# EAGLE design 2 pin plank (EAGLE 6.2)
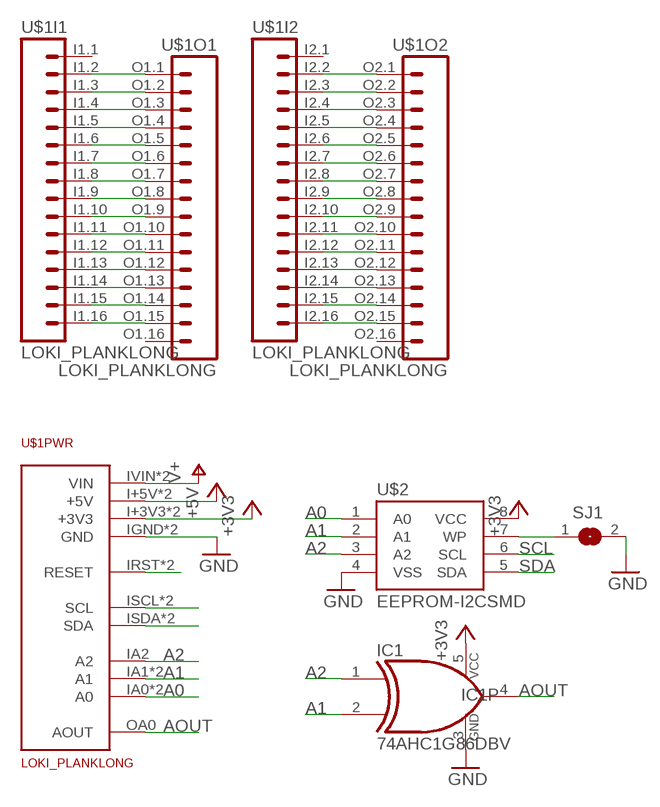
[diagram p0: schematic, sheet 1]

## Parts
IC1  74AHC1G86DBV  [SOT23-5]
SJ1  SJ  [SJ]
U$1  LOKI_PLANKLONG  [PLANK_LONG]
U$2  EEPROM-I2CSMD  [SO08]

## Nets
+3V3: IC1.5(VCC) U$1.I+3V3(PWR:+3V3) U$1.O+3V3(PWR:+3V3) U$2.8(VCC)
+5V: U$1.I+5V(PWR:+5V) U$1.O+5V(PWR:+5V)
A0: U$1.IA0(PWR:A0) U$1.OA1(PWR:A0) U$2.1(A0)
A1: IC1.2(I1) U$1.IA1(PWR:A1) U$1.OA2(PWR:A1) U$2.2(A1)
A2: IC1.1(I0) U$1.IA2(PWR:A2) U$2.3(A2)
AOUT: IC1.4(O) U$1.OA0(PWR:AOUT)
GND: IC1.3(GND) SJ1.2 U$1.IGND(PWR:GND) U$1.OGND(PWR:GND) U$2.4(VSS)
N$1: U$1.I1.16 U$1.O1.15
N$2: U$1.I1.15 U$1.O1.14
N$3: U$1.I1.14 U$1.O1.13
N$4: U$1.I1.13 U$1.O1.12
N$5: U$1.I1.12 U$1.O1.11
N$6: U$1.I1.11 U$1.O1.10
N$7: U$1.I1.10 U$1.O1.9
N$8: U$1.I1.9 U$1.O1.8
N$9: U$1.I1.8 U$1.O1.7
N$10: U$1.I1.7 U$1.O1.6
N$11: U$1.I1.6 U$1.O1.5
N$12: U$1.I1.5 U$1.O1.4
N$13: U$1.I1.4 U$1.O1.3
N$14: U$1.I1.3 U$1.O1.2
N$15: U$1.I1.2 U$1.O1.1
N$16: U$1.I2.16 U$1.O2.15
N$17: U$1.I2.15 U$1.O2.14
N$18: U$1.I2.14 U$1.O2.13
N$19: U$1.I2.13 U$1.O2.12
N$20: U$1.I2.12 U$1.O2.11
N$21: U$1.I2.11 U$1.O2.10
N$22: U$1.I2.10 U$1.O2.9
N$23: U$1.I2.9 U$1.O2.8
N$24: U$1.I2.8 U$1.O2.7
N$25: U$1.I2.7 U$1.O2.6
N$26: U$1.I2.6 U$1.O2.5
N$27: U$1.I2.5 U$1.O2.4
N$28: U$1.I2.4 U$1.O2.3
N$29: U$1.I2.3 U$1.O2.2
N$30: U$1.I2.2 U$1.O2.1
N$31: SJ1.1 U$2.7(WP)
N$32: U$1.IRST(PWR:RESET) U$1.ORST(PWR:RESET)
SCL: U$1.ISCL(PWR:SCL) U$1.OSCL(PWR:SCL) U$2.6(SCL)
SDA: U$1.ISDA(PWR:SDA) U$1.OSDA(PWR:SDA) U$2.5(SDA)
V+: U$1.IVIN(PWR:VIN) U$1.OVIN(PWR:VIN)
Unconnected: U$1.I1.1 U$1.I2.1 U$1.O1.16 U$1.O2.16

## Library data of the parts
IC1 = 74xx-little-us:74*1G86: 2-input EXCLUSIV-OR gate
SJ1 = jumper:SJ: SMD solder JUMPER
U$1 = loki:LOKI_PLANK
U$2 = SparkFun-DigitalIC:EEPROM-I2C: I2C EEPROM chips, 24LC256 (and others)

## Board
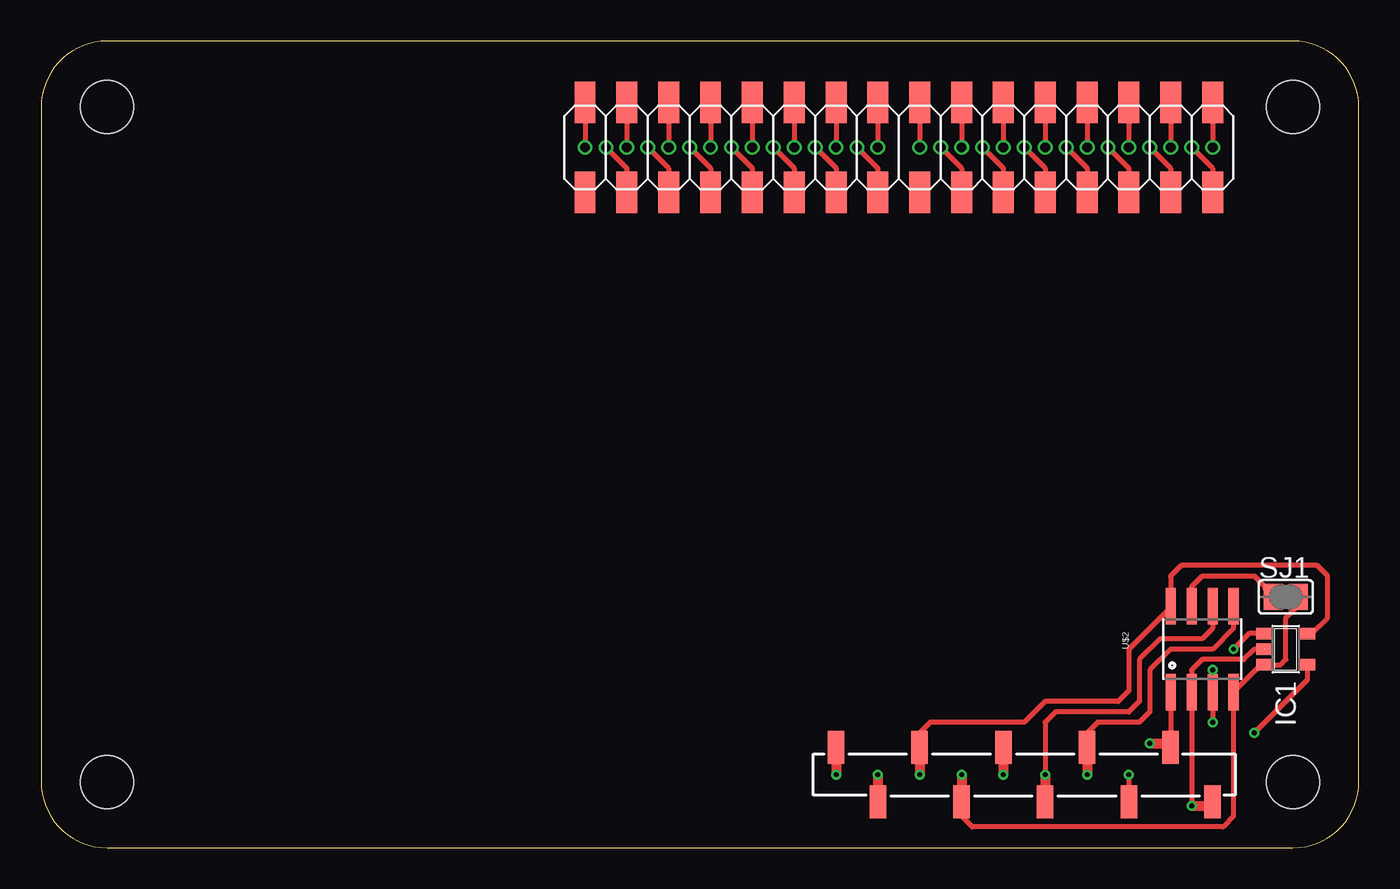
[diagram p1: board, top side]
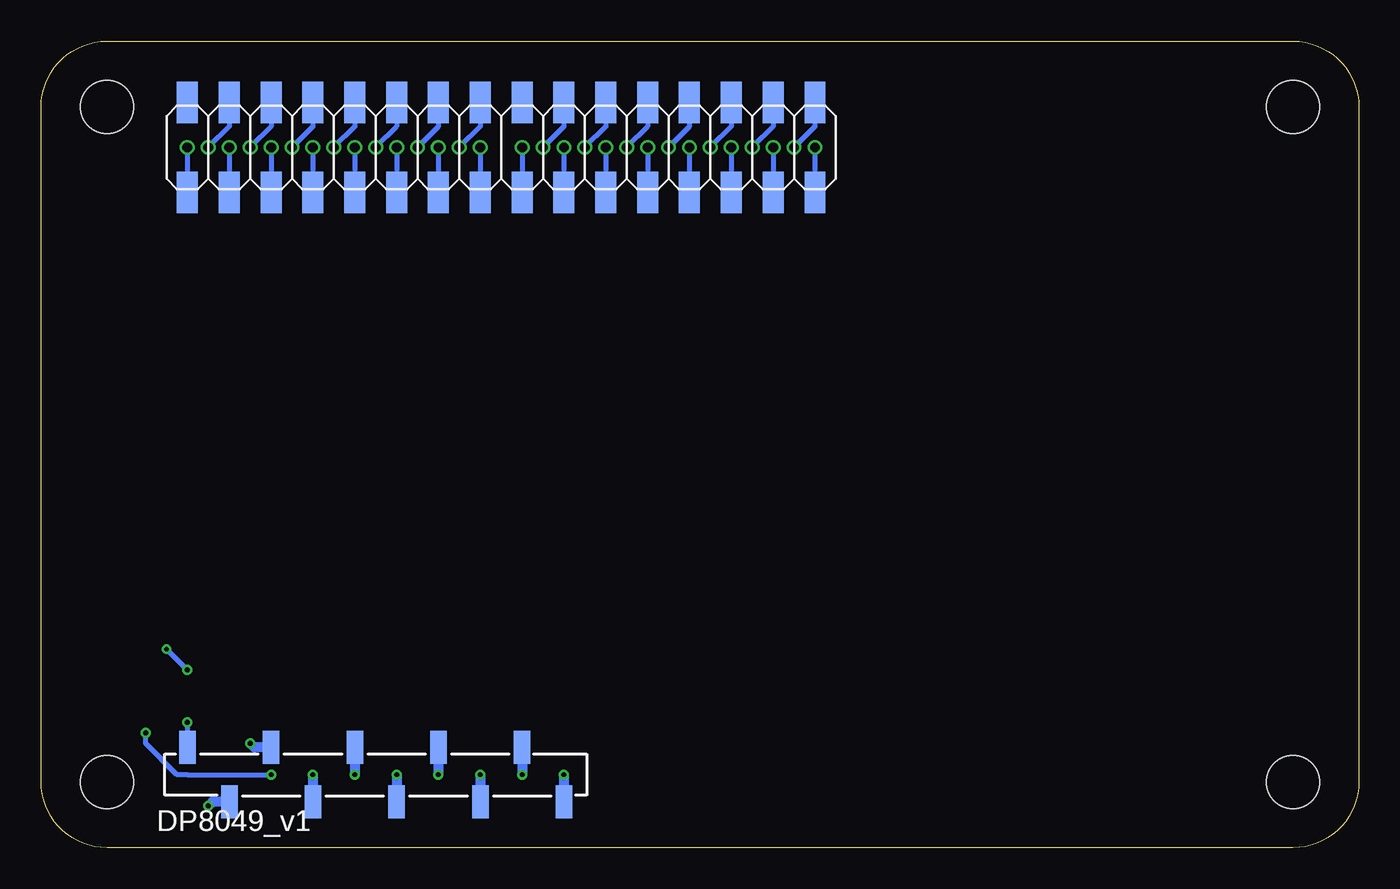
[diagram p2: board, bottom side, seen from below]

Size 80 x 49 mm. Coordinates in mm from the lower left corner, seen from the top.
Copper layers (1*16): Top 0.035mm / dielectric 1.5mm / Bottom 0.035mm
Design rules: minimum track width 6mil, minimum drill 0.3mm, track to track 6mil, track to pad 6mil, pad to pad 6mil, via to via 6mil, smd to smd 0mil, copper to edge 10mil, drill to drill 10mil, minimum pad ring 10mil, minimum via ring 6mil, stop-mask expansion 2mil, vias tented up to drill 100mil, thermal gap 10mil

### Footprints (pad centres in the part's own frame; a part is rotated, then mirrored left to right if it is on the bottom)
SOT23-5 = smd 0.69 x 0.99: 1 -0.95,-1.29; 2 0,-1.29; 3 0.95,-1.29; 4 0.95,1.3; 5 -0.95,1.3
SJ = smd 1.168 x 1.6: 1 -0.762,0; 2 0.762,0
PLANK_LONG = smd 1.27 x 2.54 bottom: I1.1 71.12,45.275; I1.2 71.12,39.815; I1.3 68.58,45.275; I1.4 68.58,39.815; I1.5 66.04,45.275; I1.6 66.04,39.815; I1.7 63.5,45.275; I1.8 63.5,39.815; I1.9 60.96,45.275; I1.10 60.96,39.815; I1.11 58.42,45.275; I1.12 58.42,39.815; I1.13 55.88,45.275; I1.14 55.88,39.815; I1.15 53.34,45.275; I1.16 53.34,39.815; I2.1 50.8,45.275; I2.2 50.8,39.815; I2.3 48.26,45.275; I2.4 48.26,39.815; I2.5 45.72,45.275; I2.6 45.72,39.815; I2.7 43.18,45.275; I2.8 43.18,39.815; I2.9 40.64,45.275; I2.10 40.64,39.815; I2.11 38.1,45.275; I2.12 38.1,39.815; I2.13 35.56,45.275; I2.14 35.56,39.815; I2.15 33.02,45.275; I2.16 33.02,39.815 | smd 1 x 2 bottom: I+3V3 53.34,2.795; I+5V 50.8,6.095; IA0 66.04,6.095; IA1 68.58,2.795; IA2 71.12,6.095; IGND 55.88,6.095; IRST 58.42,2.795; ISCL 60.96,6.095; ISDA 63.5,2.795; IVIN 48.26,2.795 | smd 1.27 x 2.54: O1.1 71.12,45.275; O1.2 71.12,39.815; O1.3 68.58,45.275; O1.4 68.58,39.815; O1.5 66.04,45.275; O1.6 66.04,39.815; O1.7 63.5,45.275; O1.8 63.5,39.815; O1.9 60.96,45.275; O1.10 60.96,39.815; O1.11 58.42,45.275; O1.12 58.42,39.815; O1.13 55.88,45.275; O1.14 55.88,39.815; O1.15 53.34,45.275; O1.16 53.34,39.815; O2.1 50.8,45.275; O2.2 50.8,39.815; O2.3 48.26,45.275; O2.4 48.26,39.815; O2.5 45.72,45.275; O2.6 45.72,39.815; O2.7 43.18,45.275; O2.8 43.18,39.815; O2.9 40.64,45.275; O2.10 40.64,39.815; O2.11 38.1,45.275; O2.12 38.1,39.815; O2.13 35.56,45.275; O2.14 35.56,39.815; O2.15 33.02,45.275; O2.16 33.02,39.815 | smd 1 x 2: O+3V3 53.34,6.095; O+5V 50.8,2.795; OA0 66.04,2.795; OA1 68.58,6.095; OA2 71.12,2.795; OGND 55.88,2.795; ORST 58.42,6.095; OSCL 60.96,2.795; OSDA 63.5,6.095; OVIN 48.26,6.095 | hole 3.2: 4,4; 76,4; 76,45; 4,45
SO08 = smd 0.61 x 2.21: 1 -1.905,-2.616; 2 -0.635,-2.616; 3 0.635,-2.616; 4 1.905,-2.616; 5 1.905,2.616; 6 0.635,2.616; 7 -0.635,2.616; 8 -1.905,2.616

### Placement (x,y rotation side)
IC1  75.56,12.06 270 top
SJ1  75.56,15.24 0 top
U$1  0,0 0 top
U$2  70.48,12.06 0 top

### Tracks (layer width: path | path; a pad name or v marks a point on that pad's centre or on a via)
+3V3  (via drill 0.3)
  Top 0.305: IC1.5 77.15,13.02 78.11,13.97 78.11,16.51 77.47,17.14 69.22,17.14 68.58,16.51 U$2.8 68.58,14.61 66.04,12.06 66.04,9.53 65.41,8.89 60.96,8.89 59.69,7.62 53.97,7.62 53.34,6.99 U$1.O+3V3
  Top 0.61: U$1.O+3V3 v53.34,4.45
  Bottom 0.61: v53.34,4.45 U$1.I+3V3
+5V  (via drill 0.3)
  Top 0.61: v50.8,4.45 U$1.O+5V
  Bottom 0.61: U$1.I+5V v50.8,4.45
A0  (via drill 0.3)
  Top 0.305: U$2.1 U$1.OA1
  Top 0.61: v67.31,6.35 68.33,6.35 U$1.OA1
  Bottom 0.61: U$1.IA0 67.06,6.09 v67.31,6.35
A1  (via drill 0.3)
  Top 0.305: v69.85,2.54 U$2.2 69.85,10.79 70.48,11.43 73.03,11.43 73.66,12.06 IC1.2
  Top 0.61: v69.85,2.54 70.87,2.54 U$1.OA2
  Bottom 0.61: U$1.IA1 69.59,2.79 v69.85,2.54
A2  (via drill 0.3)
  Top 0.305: v71.12,7.62 U$2.3 v71.12,10.79 | IC1.1 73.34,13.02 v72.39,12.06
  Bottom 0.305: v71.12,7.62 U$1.IA2 | v71.12,10.79 v72.39,12.06
AOUT  (via drill 0.3)
  Top 0.305: IC1.4 76.87,10.19 v73.66,6.99 | v66.04,4.45 U$1.OA0
  Bottom 0.305: v66.04,4.45 71.12,4.45 71.76,4.45 73.66,6.35 v73.66,6.99
GND  (via drill 0.3)
  Top 0.305: U$1.OGND 55.88,1.91 56.51,1.27 71.76,1.27 72.39,1.91 U$2.4 74.06,11.12 IC1.3 75.25,11.12 75.56,11.43 75.56,13.97 76.33,14.73 SJ1.2
  Top 0.61: v55.88,4.45 U$1.OGND
  Bottom 0.61: U$1.IGND v55.88,4.45
N$1  (via drill 0.6)
  Top 0.305: U$1.O1.15 v53.34,42.55
  Bottom 0.305: v53.34,42.55 U$1.I1.16
N$2  (via drill 0.6)
  Top 0.305: v54.61,42.55 55.88,41.27 U$1.O1.14
  Bottom 0.305: U$1.I1.15 53.34,43.81 v54.61,42.55
N$3  (via drill 0.6)
  Top 0.305: U$1.O1.13 v55.88,42.55
  Bottom 0.305: v55.88,42.55 55.88,40.64 U$1.I1.14
N$4  (via drill 0.6)
  Top 0.305: v57.15,42.55 58.42,41.27 U$1.O1.12
  Bottom 0.305: U$1.I1.13 55.88,43.81 v57.15,42.55
N$5  (via drill 0.6)
  Top 0.305: U$1.O1.11 v58.42,42.55
  Bottom 0.305: v58.42,42.55 U$1.I1.12
N$6  (via drill 0.6)
  Top 0.305: v59.69,42.55 60.96,41.27 U$1.O1.10
  Bottom 0.305: U$1.I1.11 58.42,43.81 v59.69,42.55
N$7  (via drill 0.6)
  Top 0.305: U$1.O1.9 v60.96,42.55
  Bottom 0.305: v60.96,42.55 U$1.I1.10
N$8  (via drill 0.6)
  Top 0.305: v62.23,42.55 63.5,41.27 U$1.O1.8
  Bottom 0.305: U$1.I1.9 60.96,43.81 v62.23,42.55
N$9  (via drill 0.6)
  Top 0.305: U$1.O1.7 v63.5,42.55
  Bottom 0.305: v63.5,42.55 U$1.I1.8
N$10  (via drill 0.6)
  Top 0.305: v64.77,42.55 66.04,41.27 U$1.O1.6
  Bottom 0.305: U$1.I1.7 63.5,43.81 v64.77,42.55
N$11  (via drill 0.6)
  Top 0.305: U$1.O1.5 v66.04,42.55
  Bottom 0.305: v66.04,42.55 U$1.I1.6
N$12  (via drill 0.6)
  Top 0.305: v67.31,42.55 68.58,41.27 U$1.O1.4
  Bottom 0.305: U$1.I1.5 66.04,43.81 v67.31,42.55
N$13  (via drill 0.6)
  Top 0.305: U$1.O1.3 v68.58,42.55
  Bottom 0.305: v68.58,42.55 U$1.I1.4
N$14  (via drill 0.6)
  Top 0.305: v69.85,42.55 71.12,41.27 U$1.O1.2
  Bottom 0.305: U$1.I1.3 68.58,43.81 v69.85,42.55
N$15  (via drill 0.6)
  Top 0.305: U$1.O1.1 v71.12,42.55
  Bottom 0.305: v71.12,42.55 U$1.I1.2
N$16  (via drill 0.6)
  Top 0.305: U$1.O2.15 v33.02,42.55
  Bottom 0.305: v33.02,42.55 U$1.I2.16
N$17  (via drill 0.6)
  Top 0.305: v34.29,42.55 35.56,41.27 U$1.O2.14
  Bottom 0.305: U$1.I2.15 33.02,43.81 v34.29,42.55
N$18  (via drill 0.6)
  Top 0.305: U$1.O2.13 v35.56,42.55
  Bottom 0.305: v35.56,42.55 U$1.I2.14
N$19  (via drill 0.6)
  Top 0.305: v36.83,42.55 38.1,41.27 U$1.O2.12
  Bottom 0.305: U$1.I2.13 35.56,43.81 v36.83,42.55
N$20  (via drill 0.6)
  Top 0.305: U$1.O2.11 v38.1,42.55
  Bottom 0.305: v38.1,42.55 U$1.I2.12
N$21  (via drill 0.6)
  Top 0.305: v39.37,42.55 40.64,41.27 U$1.O2.10
  Bottom 0.305: U$1.I2.11 38.1,43.81 v39.37,42.55
N$22  (via drill 0.6)
  Top 0.305: U$1.O2.9 v40.64,42.55
  Bottom 0.305: v40.64,42.55 U$1.I2.10
N$23  (via drill 0.6)
  Top 0.305: v41.91,42.55 43.18,41.27 U$1.O2.8
  Bottom 0.305: U$1.I2.9 40.64,43.81 v41.91,42.55
N$24  (via drill 0.6)
  Top 0.305: U$1.O2.7 v43.18,42.55
  Bottom 0.305: v43.18,42.55 U$1.I2.8
N$25  (via drill 0.6)
  Top 0.305: v44.45,42.55 45.72,41.27 U$1.O2.6
  Bottom 0.305: U$1.I2.7 43.18,43.81 v44.45,42.55
N$26  (via drill 0.6)
  Top 0.305: U$1.O2.5 v45.72,42.55
  Bottom 0.305: v45.72,42.55 U$1.I2.6
N$27  (via drill 0.6)
  Top 0.305: v46.99,42.55 48.26,41.27 U$1.O2.4
  Bottom 0.305: U$1.I2.5 45.72,43.81 v46.99,42.55
N$28  (via drill 0.6)
  Top 0.305: U$1.O2.3 v48.26,42.55
  Bottom 0.305: v48.26,42.55 U$1.I2.4
N$29  (via drill 0.6)
  Top 0.305: v49.53,42.55 50.8,41.27 U$1.O2.2
  Bottom 0.305: U$1.I2.3 48.26,43.81 v49.53,42.55
N$30  (via drill 0.6)
  Top 0.305: U$1.O2.1 v50.8,42.55
  Bottom 0.305: v50.8,42.55 U$1.I2.2
N$31
  Top 0.305: U$2.7 69.85,15.88 70.48,16.51 73.66,16.51 74.3,15.88 74.3,15.75 SJ1.1
N$32  (via drill 0.3)
  Top 0.61: U$1.ORST v58.42,4.45
  Bottom 0.61: v58.42,4.45 U$1.IRST
SCL  (via drill 0.3)
  Top 0.305: U$2.6 71.12,13.97 71.12,13.34 70.48,12.7 67.95,12.7 66.67,11.43 66.67,8.89 66.04,8.26 61.59,8.26 60.96,7.62 v60.96,4.45
  Top 0.61: v60.96,4.45 U$1.OSCL
  Bottom 0.61: U$1.ISCL v60.96,4.45
SDA  (via drill 0.3)
  Top 0.305: U$2.5 72.39,13.34 71.12,12.06 68.58,12.06 67.31,10.79 67.31,8.26 66.67,7.62 64.14,7.62 63.5,6.99 U$1.OSDA
  Top 0.61: U$1.OSDA v63.5,4.45
  Bottom 0.61: v63.5,4.45 U$1.ISDA
V+  (via drill 0.3)
  Top 0.61: U$1.OVIN v48.26,4.45
  Bottom 0.61: v48.26,4.45 U$1.IVIN